# Altium schematic sheet EDU_High-Speed-Design_CPU_USB.SchDoc: CPU USB
size 279 x 215 mm; Date: not used; ApprovedBy: not used; CheckedBy: not used; Author: not used; DrawnBy: not used; Organization: not used; Address4: not used; SheetNumber: 18; SheetTotal: 26; Time: not used; ImagePath: not used; Application_BuildNumber: not used
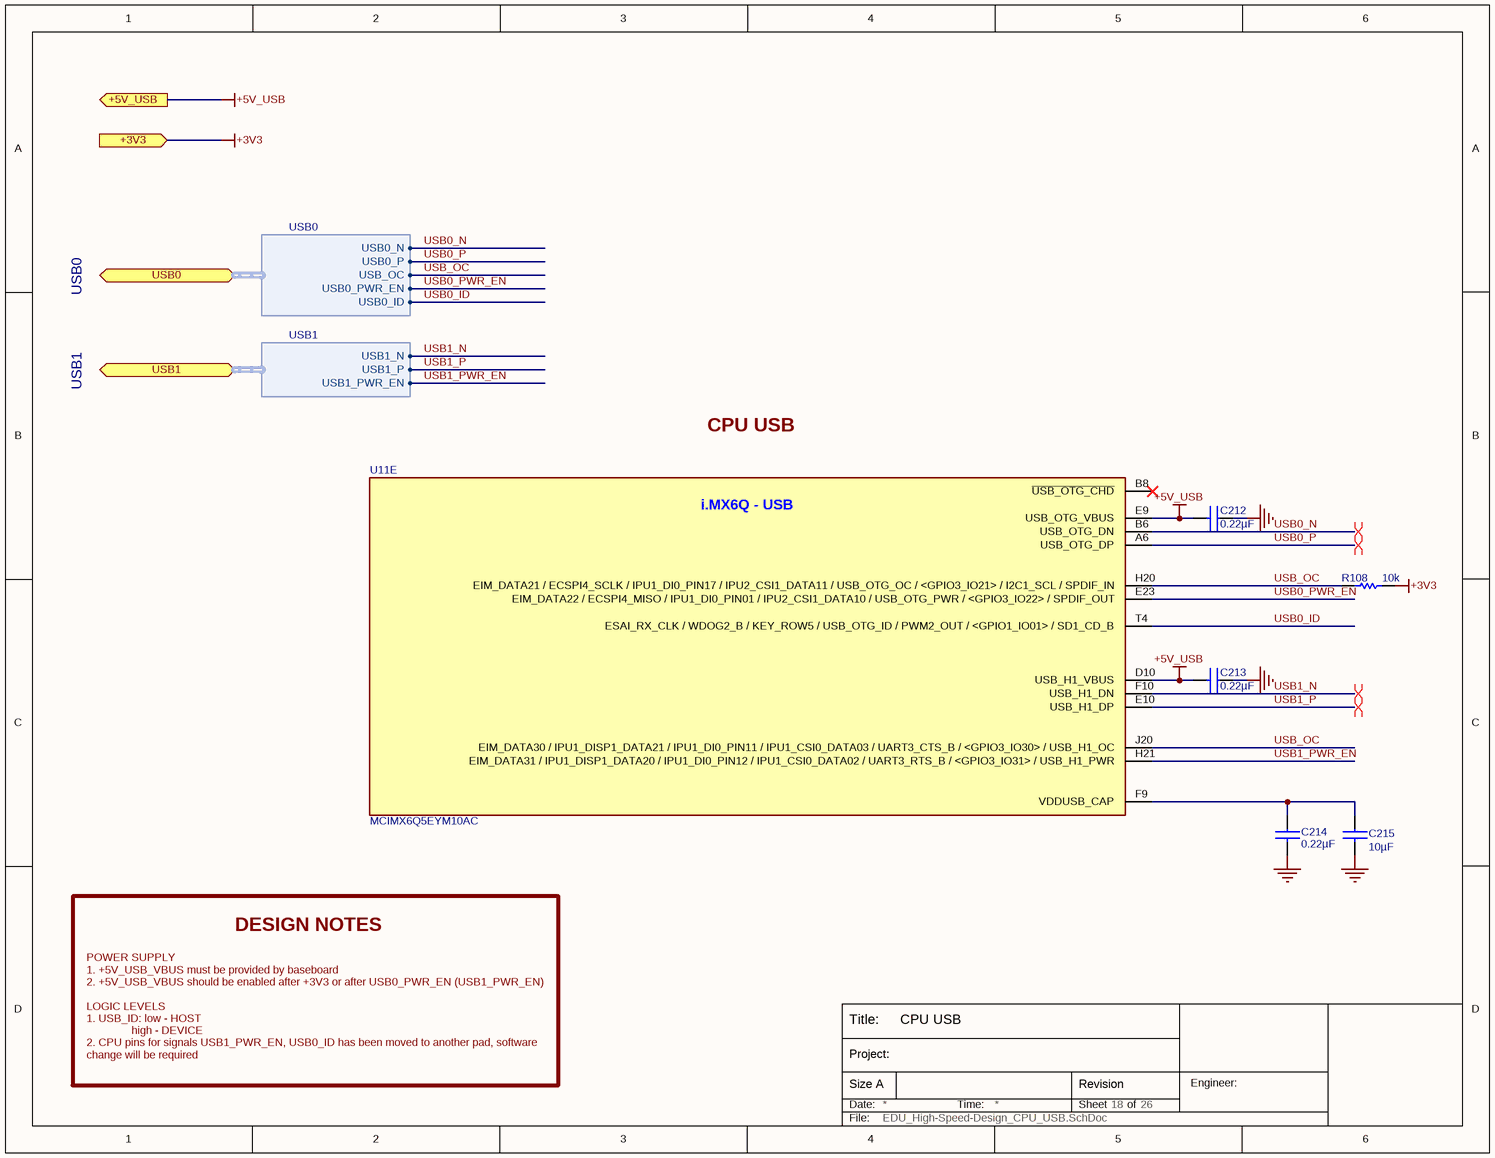
[diagram p0: EDU_High-Speed-Design_CPU_USB.SchDoc]

## Parts
C212  0.22µF  [C0402]
C213  0.22µF  [C0402]
C214  0.22µF  [C0402]
C215  10µF  [C0603]
R108  10k  [R0402]
U11  MCIMX6Q5EYM10AC  [MCIMX6Q5EYM10AC]  (part E of 15)

## Ports
+3V3 (in), +5V_USB (out), USB0 (bidir, harness USB0), USB1 (bidir, harness USB1)

## Harnesses
USB0: USB0_N, USB_OC, USB0_PWR_EN, USB0_P, USB0_ID
USB1: USB1_N, USB1_PWR_EN, USB1_P

## Nets
+3V3: R108.2 ; port +3V3
+5V_USB: C212.2 C213.2 U11.D10(USB_H1_VBUS) U11.E9(USB_OTG_VBUS) ; port +5V_USB
GND: C212.1 C213.1 C214.2 C215.2
USB0_ID: U11.T4(ESAI_RX_CLK_/_WDOG2_B_/_KEY_ROW5_/_USB_OTG_ID_/_PWM2_OUT_/_<GPIO1_IO01>_/_SD1_CD_B) ; port USB0.USB0_ID
USB0_N: U11.B6(USB_OTG_DN) ; port USB0.USB0_N
USB0_P: U11.A6(USB_OTG_DP) ; port USB0.USB0_P
USB0_PWR_EN: U11.E23(EIM_DATA22_/_ECSPI4_MISO_/_IPU1_DI0_PIN01_/_IPU2_CSI1_DATA10_/_USB_OTG_PWR_/_<GPIO3_IO22>_/_SPDIF_OUT) ; port USB0.USB0_PWR_EN
USB1_N: U11.F10(USB_H1_DN) ; port USB1.USB1_N
USB1_P: U11.E10(USB_H1_DP) ; port USB1.USB1_P
USB1_PWR_EN: U11.H21(EIM_DATA31_/_IPU1_DISP1_DATA20_/_IPU1_DI0_PIN12_/_IPU1_CSI0_DATA02_/_UART3_RTS_B_/_<GPIO3_IO31>_/_USB_H1_PWR) ; port USB1.USB1_PWR_EN
USB_OC: R108.1 U11.H20(EIM_DATA21_/_ECSPI4_SCLK_/_IPU1_DI0_PIN17_/_IPU2_CSI1_DATA11_/_USB_OTG_OC_/_<GPIO3_IO21>_/_I2C1_SCL_/_SPDIF_IN) U11.J20(EIM_DATA30_/_IPU1_DISP1_DATA21_/_IPU1_DI0_PIN11_/_IPU1_CSI0_DATA03_/_UART3_CTS_B_/_<GPIO3_IO30>_/_USB_H1_OC) ; port USB0.USB_OC
NetC214_1: C214.1 C215.1 U11.F9(VDDUSB_CAP)

Not connected (* = marked no-connect by the designer): U11 B8(~{USB_OTG_CHD})*

## Layout directives
differential pair: USB0_N, USB0_P, USB1_N, USB1_P

## Notes on the sheet
- USB0
- USB1
- CPU USB
- DESIGN NOTES
- POWER SUPPLY
  1. +5V_USB_VBUS must be provided by baseboard
  2. +5V_USB_VBUS should be enabled after +3V3 or after USB0_PWR_EN (USB1_PWR_EN)
  LOGIC LEVELS
  1. USB_ID: low - HOST
  high - DEVICE
  2. CPU pins for signals USB1_PWR_EN, USB0_ID has been moved to another pad, software change will be required
- Title:
- Date:
- Size A
- Project:
- Time:
- Sheet
- Revision
- of
- Engineer:
- File:
- (in symbol MCIMX6Q5EYM10AC, part E) i.MX6Q - USB

## Library data of the parts
C212-C214 = C1005X5R1E224M: CAP CER .22UF 25V X5R 20% 0402; Manufacturer 1: TDK Corporation; Capacitance: 0.22µF; Manufacturer Part Number 1: C1005X5R1E224M; Voltage: 25V; Supplier 1: Digi-Key; Supplier Part Number 1: 445-5945-1-ND; ComponentLink1URL: http://www.tdk.co.jp/tefe02/e412_c.pdf; ComponentLink1Description: http://www.tdk.co.jp/tefe02/e412_c.pdf
C215 = C1608X5R0J106M: CAP CER 10UF 6.3V X5R 20% 0603; Manufacturer 1: TDK Corporation; Capacitance: 10µF; Manufacturer Part Number 1: C1608X5R0J106M; Voltage: 6.3V; Supplier 1: Digi-Key; Supplier Part Number 1: 445-4112-1-ND; ComponentLink1URL: http://www.tdk.com/pdf/general_B11.pdf; ComponentLink1Description: http://www.tdk.com/pdf/general_B11.pdf
R108 = RC0402FR-0710KL: RES 10.0K OHM 1/16W 1% 0402 SMD; Manufacturer 1: Yageo; Manufacturer Part Number 1: RC0402FR-0710KL; Resistance: 10k; Supplier 1: Digi-Key; Supplier Part Number 1: 311-10.0KLRCT-ND; ComponentLink1URL: http://www.yageo.com/documents/recent/PYu-RC0402_51_RoHS_L_6.pdf; ComponentLink1Description: http://www.yageo.com/documents/recent/PYu-RC0402_51_RoHS_L_6.pdf
U11 = MCIMX6Q5EYM10AC: IC MCU 32BIT ARM QUAD 624FCBGA; Manufacturer 1: Freescale Semiconductor; Supplier 1: Digi-Key; Manufacturer Part Number 1: MCIMX6Q5EYM10AC; Supplier Part Number 1: MCIMX6Q5EYM10AC-ND